# EAGLE design boilers2 (EAGLE 7.2.0)
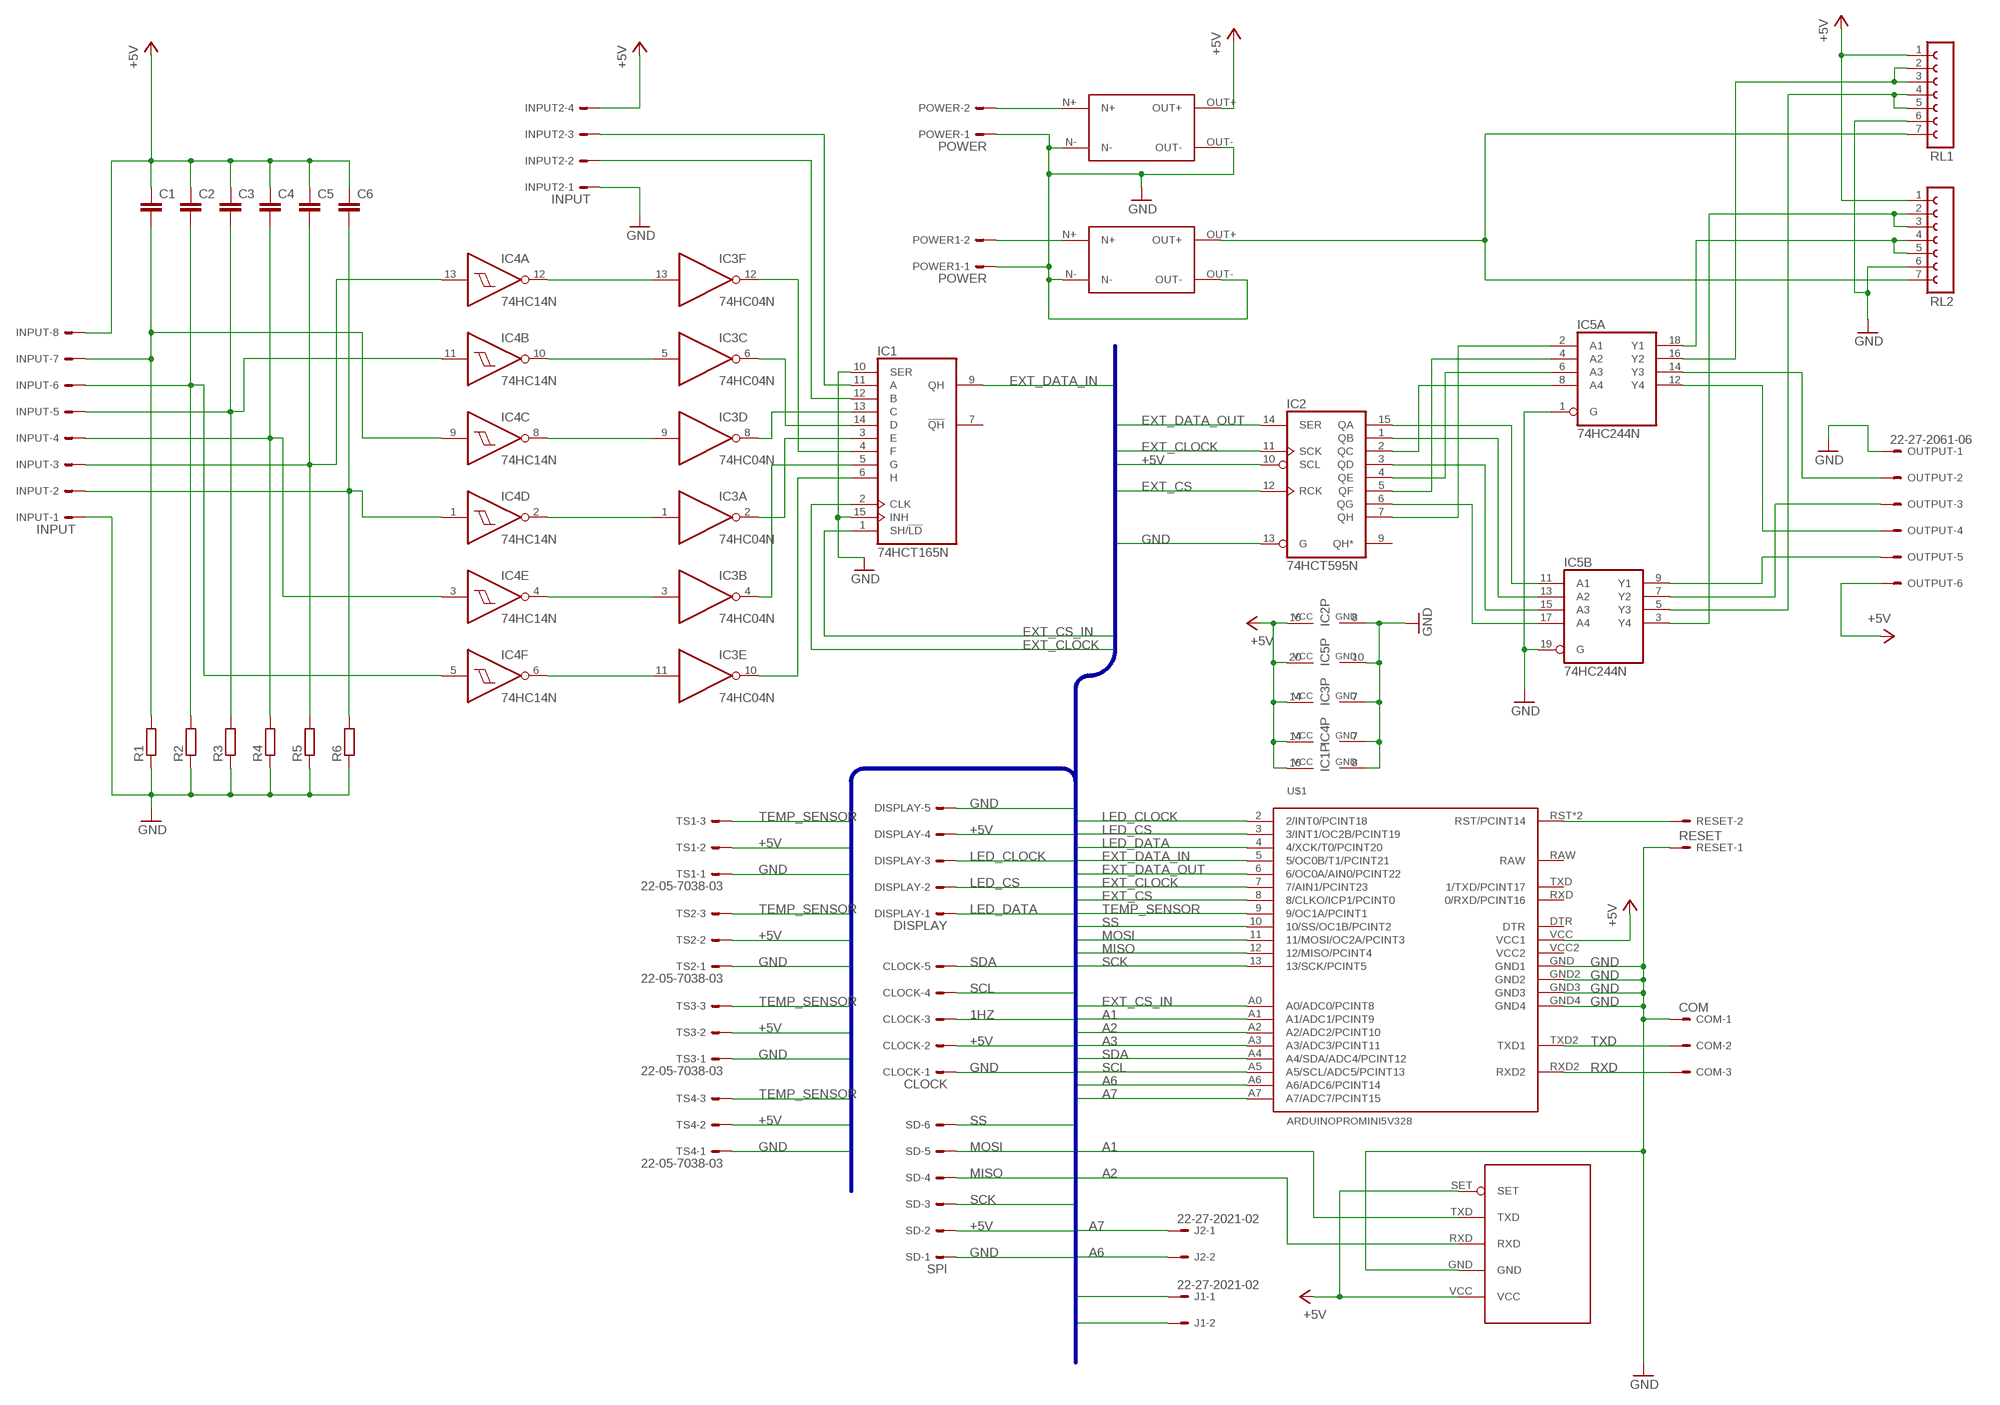
[diagram p0: schematic, sheet 1]

## Parts
C1  C-EU050-025X075  [C050-025X075]
C2  C-EU050-025X075  [C050-025X075]
C3  C-EU050-025X075  [C050-025X075]
C4  C-EU050-025X075  [C050-025X075]
C5  C-EU050-025X075  [C050-025X075]
C6  C-EU050-025X075  [C050-025X075]
CLOCK  CLOCK  22-27-2051-05  [6410-05]
COM  COM  22-27-2031-03  [6410-03]
DISPLAY  DISPLAY  22-27-2051-05  [6410-05]
IC1  74HCT165N  [DIL16]
IC2  74HCT595N  [DIL16]
IC3  74HC04N  [DIL14]
IC4  74HC14N  [DIL14]
IC5  74HC244N  [DIL20]
INPUT  INPUT  22-27-2081-08  [6410-08]
INPUT2  INPUT  22-27-2041-04  [6410-04]
J1  22-27-2021-02  [6410-02]
J2  22-27-2021-02  [6410-02]
OUTPUT  22-27-2061-06  [6410-06]
POWER  POWER  22-27-2021-02  [6410-02]
POWER1  POWER  22-27-2021-02  [6410-02]
R1  R-EU_0411/15  [0411/15]
R2  R-EU_0411/15  [0411/15]
R3  R-EU_0411/15  [0411/15]
R4  R-EU_0411/15  [0411/15]
R5  R-EU_0411/15  [0411/15]
R6  R-EU_0411/15  [0411/15]
RESET  RESET  22-27-2021-02  [6410-02]
RL1  FE07-1  [FE07]
RL2  FE07-1  [FE07]
SD  SPI  22-27-2061-06  [6410-06]
TS1  22-05-7038-03  [7395-03]
TS2  22-05-7038-03  [7395-03]
TS3  22-05-7038-03  [7395-03]
TS4  22-05-7038-03  [7395-03]
U$1  ARDUINOPROMINI5V328  [ARDUINOMINIPRO5V328]
U$4  5V_STAB  [5V_STAB]
U$5  5V_STAB  [5V_STAB]
U$6  HC-11  [HC-11]

## Nets
1HZ: CLOCK.3
+5V: C1.1 C2.1 C3.1 C4.1 C5.1 C6.1 CLOCK.2 DISPLAY.4 IC1.16(VCC) IC2.10(SCL) IC2.16(VCC) IC3.14(P:VCC) IC4.14(P:VCC) IC5.20(P:VCC) INPUT2.4 INPUT.8 J1.1 OUTPUT.6 RL1.1 RL2.1 SD.2 TS1.2 TS2.2 TS3.2 TS4.2 U$1.VCC(VCC1) U$4.OUT+ U$6.SET U$6.VCC
A1: U$1.A1(A1/ADC1/PCINT9) U$6.TXD
A2: U$1.A2(A2/ADC2/PCINT10) U$6.RXD
A3: J1.2 U$1.A3(A3/ADC3/PCINT11)
A6: J2.2 U$1.A6(A6/ADC6/PCINT14)
A7: J2.1 U$1.A7(A7/ADC7/PCINT15)
EXT_CLOCK: IC1.2(CLK) IC2.11(SCK) U$1.7(7/AIN1/PCINT23)
EXT_CS: IC2.12(RCK) U$1.8(8/CLKO/ICP1/PCINT0)
EXT_CS_IN: IC1.1(SH/!LD) U$1.A0(A0/ADC0/PCINT8)
EXT_DATA_IN: IC1.9(QH) U$1.5(5/OC0B/T1/PCINT21)
EXT_DATA_OUT: IC2.14(SER) U$1.6(6/OC0A/AIN0/PCINT22)
GND: CLOCK.1 COM.1 DISPLAY.5 IC1.8(GND) IC1.10(SER) IC1.15(INH) IC2.8(GND) IC2.13(G) IC3.7(P:GND) IC4.7(P:GND) IC5.1(A:G) IC5.10(P:GND) IC5.19(B:G) INPUT2.1 INPUT.1 OUTPUT.1 POWER1.1 POWER.1 R1.1 R2.1 R3.1 R4.1 R5.1 R6.1 RESET.1 RL1.6 RL2.6 SD.1 TS1.1 TS2.1 TS3.1 TS4.1 U$1.GND2 U$1.GND3 U$1.GND4 U$1.GND(GND1) U$4.N- U$4.OUT- U$5.N- U$5.OUT- U$6.GND
LED_CLOCK: DISPLAY.3 U$1.2(2/INT0/PCINT18)
LED_CS: DISPLAY.2 U$1.3(3/INT1/OC2B/PCINT19)
LED_DATA: DISPLAY.1 U$1.4(4/XCK/T0/PCINT20)
MISO: SD.4 U$1.12(12/MISO/PCINT4)
MOSI: SD.5 U$1.11(11/MOSI/OC2A/PCINT3)
N$1: IC3.13(F:I) IC4.12(A:O)
N$2: IC3.5(C:I) IC4.10(B:O)
N$3: IC3.9(D:I) IC4.8(C:O)
N$4: IC3.1(A:I) IC4.2(D:O)
N$5: IC3.3(B:I) IC4.4(E:O)
N$6: IC3.11(E:I) IC4.6(F:O)
N$7: IC2.15(QA) IC5.11(B:A1)
N$8: IC2.1(QB) IC5.13(B:A2)
N$9: IC2.3(QD) IC5.15(B:A3)
N$10: IC2.6(QG) IC5.17(B:A4)
N$11: IC2.7(QH) IC5.2(A:A1)
N$12: IC2.2(QC) IC5.8(A:A4)
N$13: IC2.4(QE) IC5.6(A:A3)
N$14: IC2.5(QF) IC5.4(A:A2)
N$15: IC1.11(A) INPUT2.3
N$16: IC1.5(G) IC3.4(B:O)
N$17: IC1.6(H) IC3.10(E:O)
N$18: IC1.3(E) IC3.2(A:O)
N$19: IC1.13(C) IC3.8(D:O)
N$20: IC1.14(D) IC3.6(C:O)
N$21: IC1.4(F) IC3.12(F:O)
N$22: C1.2 IC4.9(C:I) INPUT.7 R1.2
N$23: C2.2 IC4.5(F:I) INPUT.6 R2.2
N$24: IC1.12(B) INPUT2.2
N$25: IC5.16(A:Y2) RL1.2 RL1.3
N$26: C5.2 IC4.13(A:I) INPUT.3 R5.2
N$27: C6.2 IC4.1(D:I) INPUT.2 R6.2
N$28: IC5.3(B:Y4) RL2.2 RL2.3
N$29: C3.2 IC4.11(B:I) INPUT.5 R3.2
N$30: C4.2 IC4.3(E:I) INPUT.4 R4.2
N$31: IC5.18(A:Y1) RL2.4 RL2.5
N$32: IC5.5(B:Y3) RL1.4 RL1.5
N$33: IC5.14(A:Y3) OUTPUT.2
N$34: IC5.7(B:Y2) OUTPUT.3
N$35: IC5.12(A:Y4) OUTPUT.4
N$36: IC5.9(B:Y1) OUTPUT.5
N$37: POWER.2 U$4.N+
N$38: RL1.7 RL2.7 U$5.OUT+
N$39: RESET.2 U$1.RST2(RST/PCINT14) U$1.RST(RST/PCINT14)
N$40: POWER1.2 U$5.N+
RXD: COM.3 U$1.RXD2
SCK: SD.3 U$1.13(13/SCK/PCINT5)
SCL: CLOCK.4 U$1.A5(A5/SCL/ADC5/PCINT13)
SDA: CLOCK.5 U$1.A4(A4/SDA/ADC4/PCINT12)
SS: SD.6 U$1.10(10/SS/OC1B/PCINT2)
TEMP_SENSOR: TS1.3 TS2.3 TS3.3 TS4.3 U$1.9(9/OC1A/PCINT1)
TXD: COM.2 U$1.TXD2(TXD1)
Unconnected: IC1.7(!QH) IC2.9(QH*) U$1.DTR U$1.RAW U$1.RXD(0/RXD/PCINT16) U$1.TXD(1/TXD/PCINT17)

## Buses
A,B,C,D,E,F,G,H,GND,+5V,BOILER,PUMP,EXT_CLOCK,TEMP_SENSOR,SDA,SCL,1HZ,LED_DATA,LED_CS,LED_CLOCK,SS,MOSI,MISO,SCK,EXT_DATA_OUT,LOAD,EXT_CS_IN,EXT_CS,EXT_DATA_IN,A1,A2,A3,A6,A7
+5V,GND,TEMP_SENSOR

## Power pins joined to a net without a drawn wire
VCC2: U$1.VCC2

## Library data of the parts
C1-C6 = rcl:C-EU: CAPACITOR, European symbol
CLOCK DISPLAY = con-molex:22-?-05: CONNECTOR wire to board 2.54 mm (.1 inch) pitch header; OC_FARNELL: unknown; OC_NEWARK: unknown
COM TS1-TS4 = con-molex:22-?-03: CONNECTOR wire to board 2.54 mm (.1 inch) pitch header; OC_FARNELL: unknown; OC_NEWARK: unknown
IC1 = 74xx-eu:74*165: 8-bit parallel load SHIFT REGISTER
IC2 = 74xx-eu:74*595: 8-bit SHIFT REGISTER, output latch
IC3 = 74xx-eu:74*04: Hex INVERTER
IC4 = 74xx-eu:74*14: Hex schmitt trigger INVERTER
IC5 = 74xx-eu:74*244: Octal BUFFER and LINE DRIVER, 3-state
INPUT = con-molex:22-?-08: CONNECTOR wire to board 2.54 mm (.1 inch) pitch header; OC_FARNELL: unknown; OC_NEWARK: unknown
INPUT2 = con-molex:22-?-04: CONNECTOR wire to board 2.54 mm (.1 inch) pitch header; OC_FARNELL: unknown; OC_NEWARK: unknown
J1 J2 POWER POWER1 RESET = con-molex:22-?-02: CONNECTOR wire to board 2.54 mm (.1 inch) pitch header; OC_FARNELL: unknown; OC_NEWARK: unknown
OUTPUT SD = con-molex:22-?-06: CONNECTOR wire to board 2.54 mm (.1 inch) pitch header; OC_FARNELL: unknown; OC_NEWARK: unknown
R1-R6 = rcl:R-EU_: RESISTOR, European symbol
RL1 RL2 = con-lsta:FE07-1: FEMALE HEADER; OC_FARNELL: unknown; OC_NEWARK: unknown
U$1 = arduino:ARDUINOPROMINI5V328
U$4 U$5 = arduino:5V_STAB
U$6 = arduino:HC-11

## Board
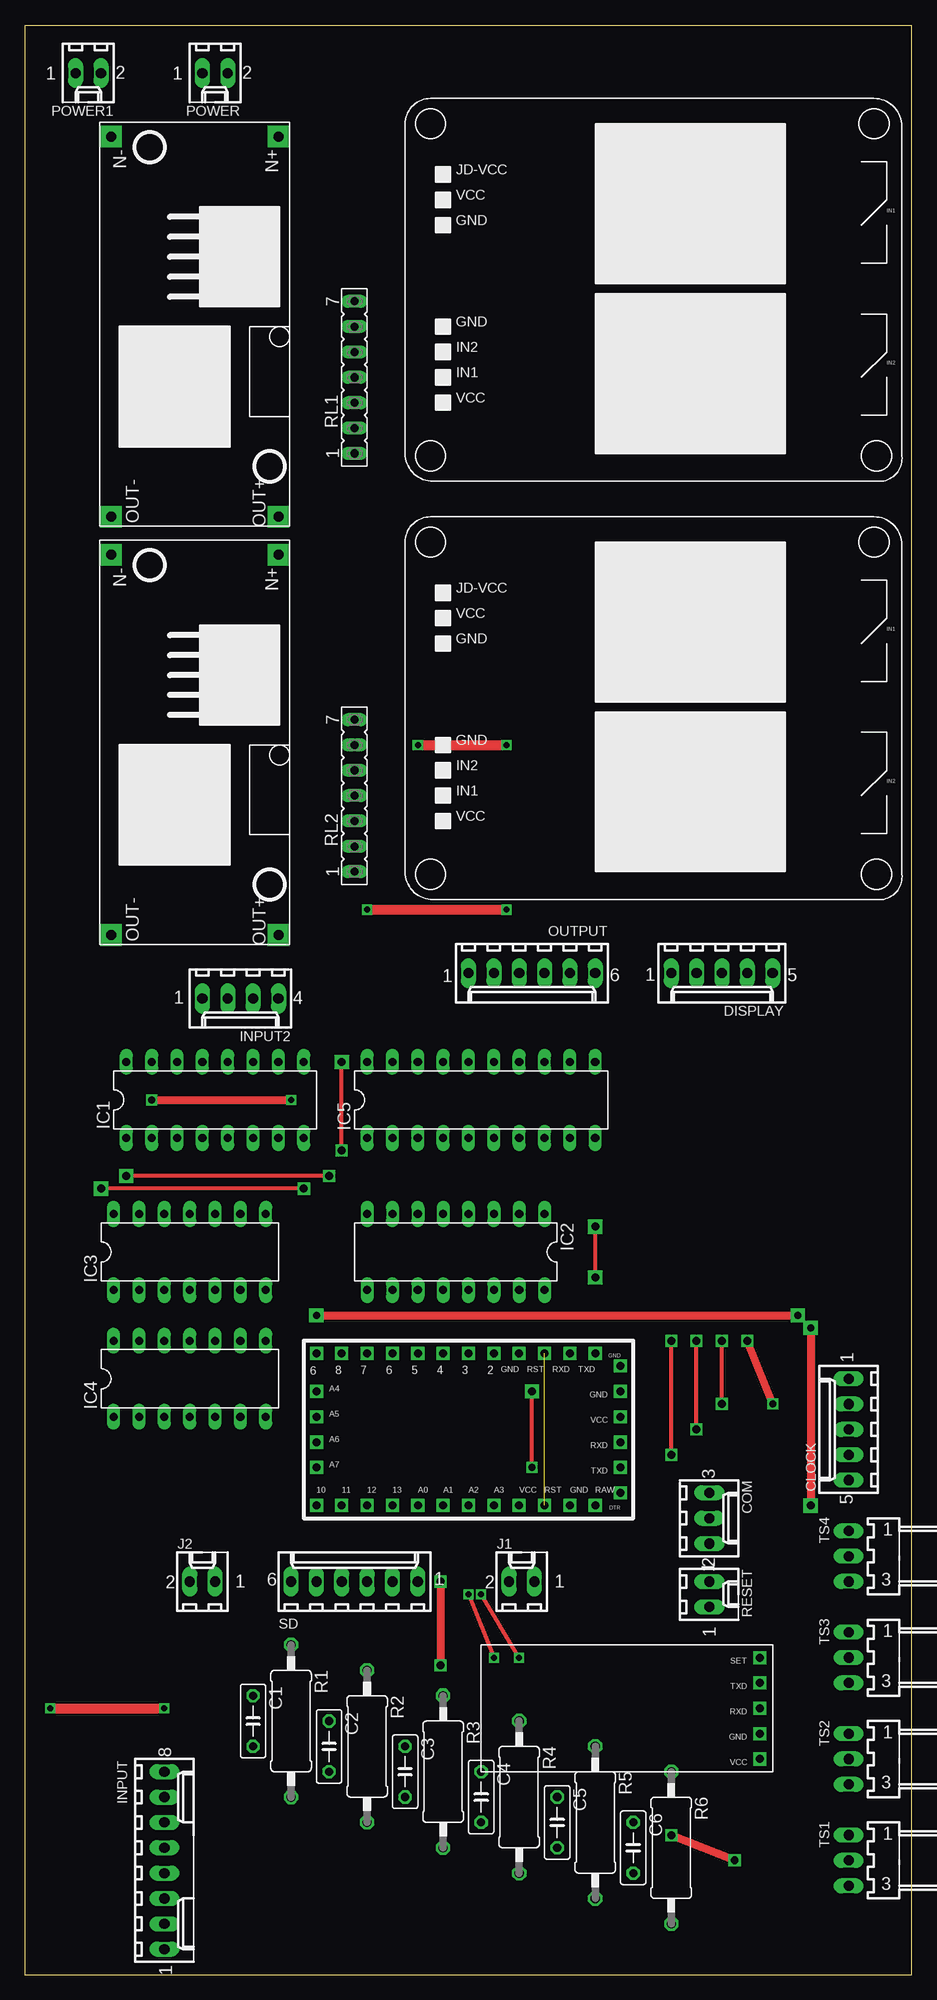
[diagram p1: board, top side]
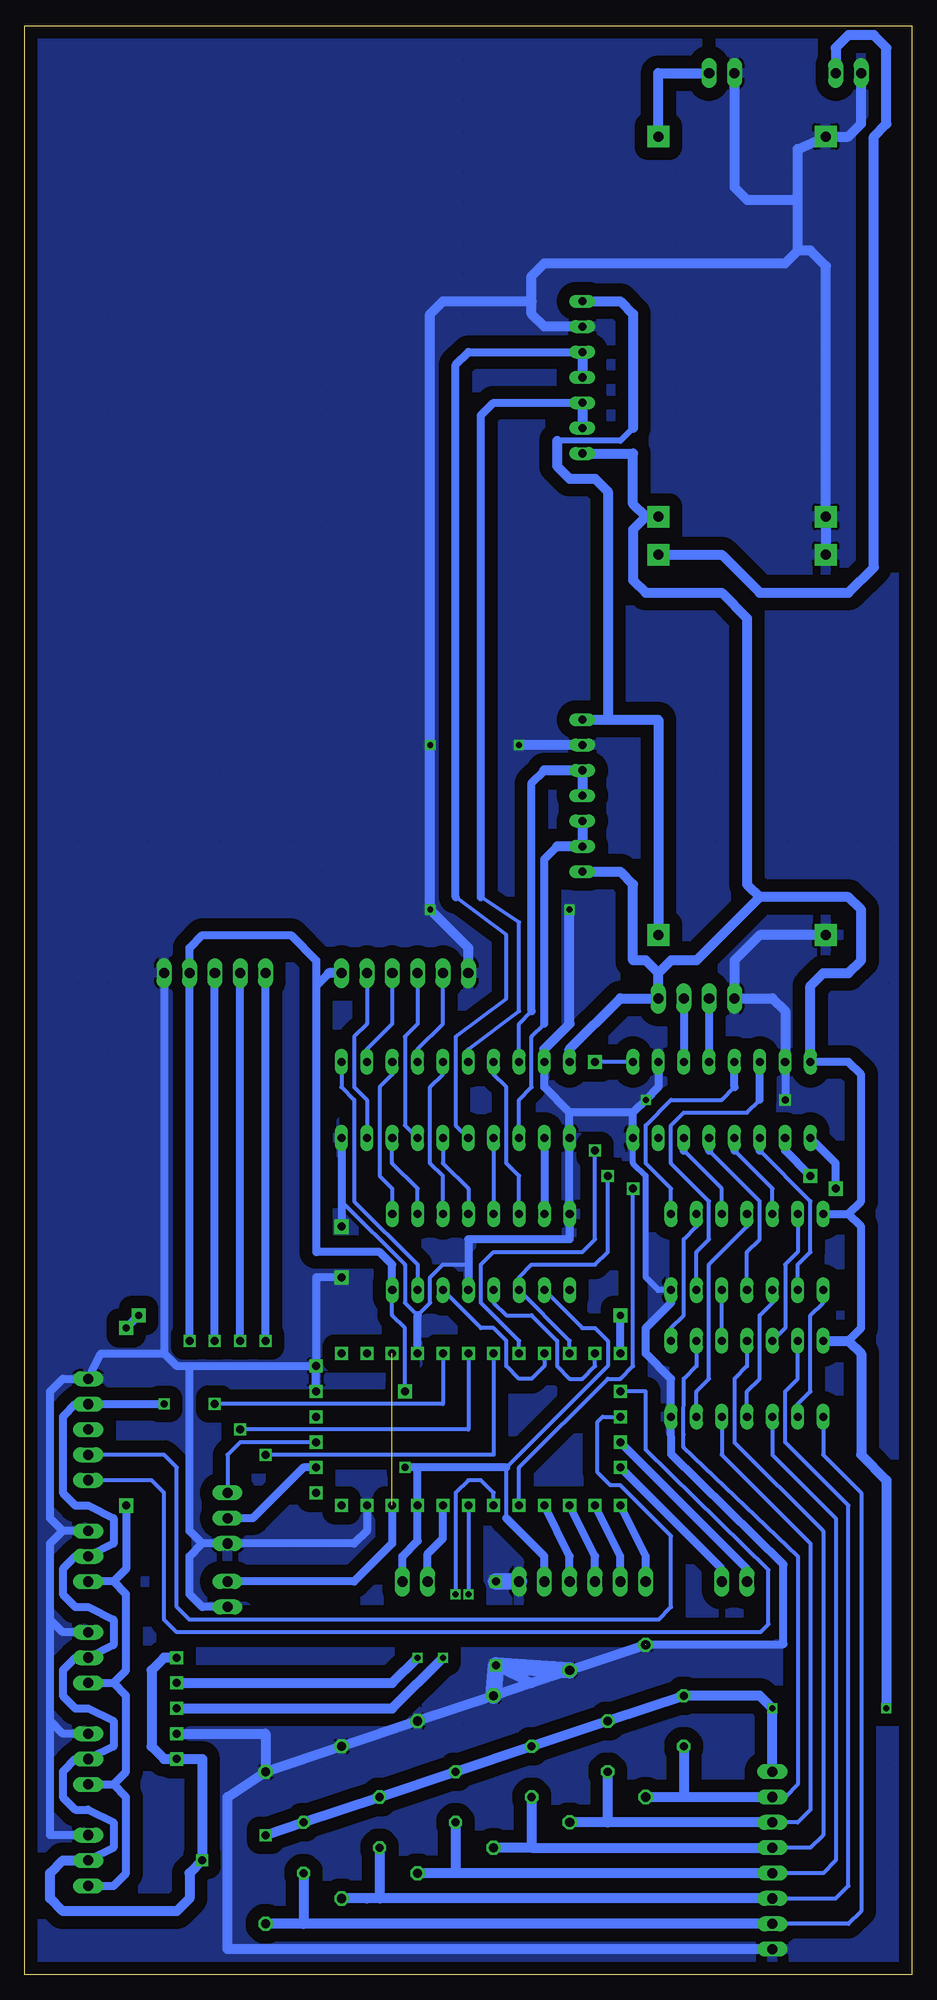
[diagram p2: board, bottom side, seen from below]

Size 88.88 x 195.25 mm. Coordinates in mm from the lower left corner, seen from the top.
Outline: 0,0 88.88,0 88.88,195.25 0,195.25 0,0
Copper layers (1*16): Top 0.035mm / dielectric 1.5mm / Bottom 0.035mm
Design rules "default": minimum track width 10mil, minimum drill 24mil, track to track 8mil, track to pad 8mil, pad to pad 8mil, via to via 8mil, smd to smd 8mil, copper to edge 40mil, drill to drill 8mil, minimum pad ring 10mil, minimum via ring 8mil, stop-mask expansion 4mil, vias tented up to drill 0mil, thermal gap 10mil

### Footprints (pad centres in the part's own frame; a part is rotated, then mirrored left to right if it is on the bottom)
C050-025X075 = drill 0.813 octagon: 1 -2.54,0; 2 2.54,0
6410-05 = drill 1.016 long: 1 5.08,0; 2 2.54,0; 3 0,0; 4 -2.54,0; 5 -5.08,0
6410-03 = drill 1.016 long: 1 2.54,0; 2 0,0; 3 -2.54,0
DIL16 = drill 0.813 long: 1 -8.89,-3.81; 2 -6.35,-3.81; 3 -3.81,-3.81; 4 -1.27,-3.81; 5 1.27,-3.81; 6 3.81,-3.81; 7 6.35,-3.81; 8 8.89,-3.81; 9 8.89,3.81; 10 6.35,3.81; 11 3.81,3.81; 12 1.27,3.81; 13 -1.27,3.81; 14 -3.81,3.81; 15 -6.35,3.81; 16 -8.89,3.81
DIL14 = drill 0.813 long: 1 -7.62,-3.81; 2 -5.08,-3.81; 3 -2.54,-3.81; 4 0,-3.81; 5 2.54,-3.81; 6 5.08,-3.81; 7 7.62,-3.81; 8 7.62,3.81; 9 5.08,3.81; 10 2.54,3.81; 11 0,3.81; 12 -2.54,3.81; 13 -5.08,3.81; 14 -7.62,3.81
DIL20 = drill 0.813 long: 1 -11.43,-3.81; 2 -8.89,-3.81; 3 -6.35,-3.81; 4 -3.81,-3.81; 5 -1.27,-3.81; 6 1.27,-3.81; 7 3.81,-3.81; 8 6.35,-3.81; 9 8.89,-3.81; 10 11.43,-3.81; 11 11.43,3.81; 12 8.89,3.81; 13 6.35,3.81; 14 3.81,3.81; 15 1.27,3.81; 16 -1.27,3.81; 17 -3.81,3.81; 18 -6.35,3.81; 19 -8.89,3.81; 20 -11.43,3.81
6410-08 = drill 1.016 long: 1 8.89,0; 2 6.35,0; 3 3.81,0; 4 1.27,0; 5 -1.27,0; 6 -3.81,0; 7 -6.35,0; 8 -8.89,0
6410-04 = drill 1.016 long: 1 3.81,0; 2 1.27,0; 3 -1.27,0; 4 -3.81,0
6410-02 = drill 1.016 long: 1 1.27,0; 2 -1.27,0
6410-06 = drill 1.016 long: 1 6.35,0; 2 3.81,0; 3 1.27,0; 4 -1.27,0; 5 -3.81,0; 6 -6.35,0
0411/15 = drill 0.914 octagon: 1 -7.62,0; 2 7.62,0
FE07 = drill 0.813 long: 1 -7.62,0; 2 -5.08,0; 3 -2.54,0; 4 0,0; 5 2.54,0; 6 5.08,0; 7 7.62,0
7395-03 = drill 1.016 long: 1 2.54,0; 2 0,0; 3 -2.54,0
ARDUINOMINIPRO5V328 = drill 0.8 square: 2 -3.81,-3.81; 3 -1.27,-3.81; 4 1.27,-3.81; 5 3.81,-3.81; 6 6.35,-3.81; 7 8.89,-3.81; 8 11.43,-3.81; 9 13.97,-3.81; 10 13.97,11.43; 11 11.43,11.43; 12 8.89,11.43; 13 6.35,11.43; A0 3.81,11.43; A1 1.27,11.43; A2 -1.27,11.43; A3 -3.81,11.43; A4 13.97,0; A5 13.97,2.54; A6 13.97,5.08; A7 13.97,7.62; DTR -16.51,10.16; GND -6.35,-3.81; GND2 -11.43,11.43; GND3 -16.51,0; GND4 -16.51,-2.54; RAW -13.97,11.43; RST -8.89,-3.81; RST2 -8.89,11.43; RXD -11.43,-3.81; RXD2 -16.51,5.08; TXD -13.97,-3.81; TXD2 -16.51,7.62; VCC -6.35,11.43; VCC2 -16.51,2.54
5V_STAB = drill 1 pad 2.184 square: N+ -19.05,8.89; N- -19.05,-7.89; OUT+ 19.05,8.89; OUT- 19.05,-7.89
HC-11 = drill 0.8 square: GND -7.62,2.54; RXD -7.62,0; SET -7.62,-5.08; TXD -7.62,-2.54; VCC -7.62,5.08

### Placement (x,y rotation side)
C1  22.86,25.4 270 top
C2  30.48,22.86 270 top
C3  38.1,20.32 270 top
C4  45.72,17.78 270 top
C5  53.34,15.24 270 top
C6  60.96,12.7 270 top
CLOCK  82.55,54.61 90 top
COM  68.58,45.72 270 top
DISPLAY  69.85,100.33 180 top
IC1  19.05,87.63 0 top
IC2  43.18,72.39 180 top
IC3  16.51,72.39 0 top
IC4  16.51,59.69 0 top
IC5  45.72,87.63 0 top
INPUT  13.97,11.43 270 top
INPUT2  21.59,97.79 180 top
J1  49.78,39.37 0 top
J2  17.78,39.37 0 top
OUTPUT  50.8,100.33 180 top
POWER  19.05,190.5 180 top
POWER1  6.35,190.5 180 top
R1  26.67,25.4 270 top
R2  34.29,22.86 270 top
R3  41.91,20.32 270 top
R4  49.53,17.78 270 top
R5  57.15,15.24 270 top
R6  64.77,12.7 270 top
RESET  68.58,38.1 270 top
RL1  33.02,160.02 90 top
RL2  33.02,118.11 90 top
SD  33.02,39.37 0 top
TS1  82.55,11.43 90 top
TS2  82.55,21.59 90 top
TS3  82.55,31.75 90 top
TS4  82.55,41.91 90 top
U$1  43.18,58.42 180 top
U$2  [2CHAN_RELAY_5V]  64.77,134.62 0 top
U$3  [2CHAN_RELAY_5V]  64.77,176.53 0 top
U$4  16.51,165.1 270 top
U$5  16.51,123.19 270 top
U$6  66.04,26.67 180 top

### Tracks (layer width: path | path; a pad name or v marks a point on that pad's centre or on a via)
+5V  (via drill 0.6, 0.7, 0.8, 0.8 pad 1.42)
  Top 0.406: v50.8,50.8 v50.8,58.42
  Top 0.813: v74.93,57.15 v72.39,63.5 | v64.77,13.97 v71.12,11.43
  Top 1.016: v2.54,26.67 v13.97,26.67
  Bottom 0.406: v50.8,58.42 50.8,64.77 52.07,66.04 IC2.16 | IC2.10 33.02,64.77 31.75,64.77 30.48,63.5 30.48,60.96 40.64,50.8 40.64,45.72
  Bottom 0.61: 39.37,44.45 40.64,45.72
  Bottom 0.813: 58.42,100.33 59.69,99.06 | 59.69,99.06 59.69,72.39 53.34,72.39 52.07,71.12 IC2.16 | 6.35,63.5 5.08,64.77 5.08,74.93 6.35,76.2 | IC3.14 6.35,76.2 | 6.35,76.2 5.08,77.47 5.08,90.17 6.35,91.44 IC1.16 | 59.69,99.06 59.69,101.6 62.23,104.14 71.12,104.14 72.39,102.87 DISPLAY.4 v72.39,63.5 | 40.64,50.8 49.53,50.8 | 49.53,50.8 v50.8,50.8 | 49.53,50.8 U$1.VCC 49.53,43.43 51.05,41.91 J1.1 | v74.93,57.15 CLOCK.2 83.82,57.15 85.09,55.88 85.09,48.26 83.82,46.99 82.55,46.99 80.01,45.72 80.01,43.18 TS4.2 83.82,41.91 85.09,40.64 85.09,38.1 83.82,36.83 82.55,36.83 80.01,35.56 80.01,33.02 TS3.2 83.82,31.75 85.09,30.48 85.09,27.94 83.82,26.67 82.55,26.67 80.01,25.4 80.01,22.86 TS2.2 83.82,21.59 85.09,20.32 85.09,17.78 83.82,16.51 82.55,16.51 80.01,15.24 80.01,12.7 TS1.2 | SD.2 36.83,41.91 40.64,45.72
  Bottom 1.016: INPUT.8 v13.97,26.67 15.24,27.94 C1.1 C2.1 C3.1 C4.1 C5.1 C6.1 v64.77,13.97 | TS1.2 85.09,11.43 86.36,10.16 86.36,7.62 85.09,6.35 73.66,6.35 72.39,7.62 72.39,10.16 v71.12,11.43 71.12,21.59 U$6.VCC 74.93,21.59 76.2,22.86 76.2,30.48 74.93,31.75 U$6.SET | OUTPUT.6 58.42,100.33 | U$4.OUT+ 26.67,146.05 | 26.67,146.05 27.94,147.32 27.94,152.4 RL1.1 | IC1.16 10.16,99.06 8.89,100.33 6.35,100.33 5.08,101.6 5.08,106.68 6.35,107.95 15.24,107.95 | 15.24,107.95 21.59,101.6 24.13,101.6 25.4,100.33 | 25.4,100.33 INPUT2.4 29.21,97.79 34.29,92.71 IC5.20 | 25.4,100.33 26.67,101.6 27.94,101.6 27.94,109.22 29.21,110.49 RL2.1 | 26.67,146.05 27.94,144.78 27.94,139.7 26.67,138.43 19.05,138.43 16.51,135.89 16.51,109.22 15.24,107.95 | IC4.14 6.35,63.5 5.08,62.23 5.08,52.07 2.54,49.53 v2.54,26.67
A1  (via drill 0.6)
  Top 0.406: v45.72,38.1 v49.53,31.75
  Bottom 0.406: U$1.A1 41.91,48.26 43.18,49.53 44.45,49.53 45.72,48.26 v45.72,38.1
  Bottom 1.016: v49.53,31.75 52.07,29.21 U$6.TXD
A2  (via drill 0.6)
  Top 0.406: v44.45,38.1 v46.99,31.75
  Bottom 0.406: U$1.A2 v44.45,38.1
  Bottom 1.016: v46.99,31.75 52.07,26.67 U$6.RXD
A3
  Bottom 0.813: J1.2 48.51,42.16 46.99,43.69 U$1.A3
A6
  Bottom 0.813: U$1.A6 16.51,40.64 J2.2
A7
  Bottom 0.813: U$1.A7 19.05,40.64 J2.1
EXT_CLOCK  (via drill 0.8, 0.8 pad 1.42)
  Top 0.406: v30.48,80.01 v10.16,80.01
  Bottom 0.406: U$1.7 34.29,63.5 IC2.11 39.37,69.85 38.1,71.12 31.75,71.12 30.48,72.39 v30.48,80.01
  Bottom 0.813: v10.16,80.01 12.7,82.55 IC1.2
EXT_CS
  Bottom 0.406: IC2.12 41.91,67.31 40.64,66.04 38.1,66.04 35.56,63.5 35.56,60.96 34.29,59.69 33.02,59.69 31.75,60.96 U$1.8
EXT_CS_IN  (via drill 0.8 pad 1.27, 0.8 pad 1.42)
  Top 0.406: v27.94,78.74 v7.62,78.74
  Bottom 0.406: U$1.A0 39.37,50.8 30.48,59.69 29.21,59.69 27.94,60.96 v27.94,78.74
  Bottom 0.813: v7.62,78.74 7.62,81.28 IC1.1
EXT_DATA_IN  (via drill 0.8, 0.8 pad 1.42)
  Top 0.406: v31.75,82.55 v31.75,91.44
  Bottom 0.406: v31.75,82.55 31.75,73.66 33.02,72.39 41.91,72.39 43.18,71.12 43.18,67.31 39.37,63.5 U$1.5 | IC1.9 v31.75,91.44
EXT_DATA_OUT
  Bottom 0.406: U$1.6 36.83,60.96 38.1,59.69 39.37,59.69 40.64,60.96 40.64,63.5 41.91,64.77 43.18,64.77 IC2.14
GND  (via drill 0.6, 0.7, 0.8, 0.8 pad 1.42)  (1 unrouted)
  Top 0.406: v57.15,69.85 v57.15,74.93
  Top 0.813: v12.7,87.63 v26.67,87.63 | v41.66,39.37 v41.66,30.99
  Top 1.016: v39.37,123.19 v48.26,123.19 | v34.29,106.68 v48.26,106.68
  Bottom 0.406: 44.45,71.12 46.99,71.12 48.26,69.85 48.26,67.31 49.53,66.04 50.8,67.31 50.8,71.12 57.15,77.47 v57.15,74.93
  Bottom 0.61: IC3.7 25.4,68.58 26.67,69.85 26.67,80.01 27.94,81.28 IC1.8
  Bottom 0.813: 34.29,86.36 IC5.1 IC2.8 34.29,73.66 44.45,73.66 44.45,71.12 IC2.13 | 34.29,86.36 36.83,88.9 IC5.19 | IC1.10 25.4,88.9 v26.67,87.63 27.94,86.36 | IC3.7 24.13,67.31 26.67,64.77 26.67,62.23 24.13,59.69 IC4.7 24.11,52.13 12.87,41.08 12.87,33.1 26.64,33.1 | IC1.15 v12.7,87.63 | IC5.10 v57.15,74.93 | v57.15,69.85 59.69,69.85 U$1.GND4 | DISPLAY.5 74.93,62.23 | 74.93,62.23 73.66,60.96 72.39,60.96 | 72.39,60.96 U$1.GND4 | 71.12,43.18 COM.1 55.88,43.18 54.61,44.45 U$1.GND2 | 71.12,43.18 72.39,44.45 72.39,60.96 | RESET.1 71.12,36.83 72.39,38.1 72.39,41.91 71.12,43.18 | U$1.GND3 U$1.GND4 | TS3.1 85.09,34.29 86.36,35.56 | 86.36,35.56 86.36,43.18 85.09,44.45 | TS2.1 85.09,24.13 86.36,25.4 | 86.36,25.4 86.36,35.56 | TS1.1 86.36,13.97 86.36,25.4 | 74.93,62.23 81.28,62.23 CLOCK.1 85.09,59.69 86.36,58.42 86.36,45.72 85.09,44.45 | TS4.1 85.09,44.45 | U$1.GND 49.53,66.04 | IC1.8 27.94,86.36 | 27.94,86.36 34.29,86.36
  Bottom 1.016: 38.1,29.21 R2.1 R1.1 | 38.1,29.21 R3.1 R4.1 R5.1 R6.1 | v41.66,30.99 38.1,29.21 | INPUT.1 68.58,2.54 68.58,17.78 R6.1 | 38.1,167.64 38.1,166.37 36.83,165.1 RL1.6 | 38.1,167.64 38.1,170.18 36.83,171.45 12.7,171.45 11.43,172.72 | 11.43,172.72 11.43,177.8 | 11.43,177.8 11.43,182.88 U$4.N- 6.35,184.15 5.08,185.42 POWER1.1 | OUTPUT.1 44.45,102.87 v48.26,106.68 v48.26,123.19 48.26,166.37 46.99,167.64 38.1,167.64 | POWER.1 17.78,179.07 16.51,177.8 11.43,177.8 | U$5.N- U$4.OUT- 8.62,171.18 10.16,172.72 11.43,172.72 | U$5.OUT- 15.24,104.14 17.78,101.6 INPUT2.1 13.97,97.79 12.7,96.52 IC1.15 | IC5.19 36.83,92.71 34.29,95.25 v34.29,106.68 | RL2.6 v39.37,123.19 | R6.1 64.77,24.13 U$6.GND
  Bottom 1.676: SD.1 v41.66,39.37 | R3.1 v41.66,30.99 R2.1
  pour Bottom (isolate 1.27, hatched): 0,195.58 88.9,195.58 88.9,0 0,0
LED_CLOCK  (via drill 0.8)
  Top 0.406: v69.85,57.15 v69.85,63.5
  Bottom 0.406: U$1.2 46.99,57.15 v69.85,57.15
  Bottom 0.813: v69.85,63.5 DISPLAY.3
LED_CS  (via drill 0.8)
  Top 0.406: v67.31,54.61 v67.31,63.5
  Bottom 0.406: U$1.3 44.45,54.61 v67.31,54.61
  Bottom 0.813: v67.31,63.5 DISPLAY.2
LED_DATA  (via drill 0.8)
  Top 0.406: v64.77,52.07 v64.77,63.5
  Bottom 0.406: U$1.4 41.91,52.07 v64.77,52.07
  Bottom 0.813: v64.77,63.5 DISPLAY.1
MISO
  Bottom 0.813: SD.4 31.75,41.91 U$1.12
MOSI
  Bottom 0.813: SD.5 29.21,41.91 U$1.11
N$1
  Bottom 0.406: IC3.13 11.43,72.39 12.7,71.12 12.7,64.77 IC4.12
N$2
  Bottom 0.406: IC4.10 IC3.5
N$3
  Bottom 0.406: IC4.8 24.13,64.77 22.86,66.04 22.86,73.66 21.59,74.93 IC3.9
N$4
  Bottom 0.406: IC4.2 11.43,57.15 10.16,58.42 10.16,66.04 8.89,67.31 IC3.1
N$5
  Bottom 0.406: IC4.4 16.51,58.42 15.24,59.69 15.24,66.04 13.97,67.31 IC3.3
N$6
  Bottom 0.406: IC4.6 21.59,58.42 20.32,59.69 20.32,71.12 16.51,74.93 IC3.11
N$7
  Bottom 0.406: IC5.11 57.15,88.9 55.88,87.63 55.88,77.47 49.53,71.12 IC2.15 49.53,69.85
N$8
  Bottom 0.406: IC5.13 52.07,90.17 53.34,88.9 53.34,80.01 52.07,78.74 IC2.1
N$9
  Bottom 0.406: IC2.3 46.99,80.01 48.26,81.28 48.26,88.9 46.99,90.17 IC5.15
N$10
  Bottom 0.406: IC2.6 39.37,80.01 40.64,81.28 40.64,88.9 41.91,90.17 IC5.17
N$11
  Bottom 0.813: IC5.2 IC2.7
N$12
  Bottom 0.406: IC2.2 49.53,78.74 52.07,81.28 IC5.8
N$13
  Bottom 0.406: IC5.6 46.99,81.28 44.45,78.74 IC2.4
N$14
  Bottom 0.406: IC5.4 IC2.5
N$15
  Bottom 0.813: INPUT2.3 IC1.11
N$16
  Bottom 0.406: IC3.4 16.51,72.39 15.24,73.66 15.24,77.47 20.32,82.55
  Bottom 0.813: 20.32,82.55 IC1.5
N$17
  Bottom 0.406: IC3.10 19.05,78.74 22.86,82.55
  Bottom 0.813: 22.86,82.55 IC1.6
N$18
  Bottom 0.406: IC3.2 11.43,71.12 10.16,72.39 10.16,77.47 15.24,82.55
  Bottom 0.813: 15.24,82.55 IC1.3
N$19
  Bottom 0.406: IC3.8 24.13,78.74 26.67,81.28 26.67,85.09 24.13,87.63 19.05,87.63 17.78,88.9
  Bottom 0.813: 17.78,88.9 IC1.13
N$20
  Bottom 0.406: IC3.6 21.59,72.39 20.32,73.66 20.32,77.47 24.13,81.28 24.13,85.09 22.86,86.36 16.51,86.36 15.24,87.63
  Bottom 0.813: 15.24,87.63 IC1.14
N$21
  Bottom 0.406: IC3.12 13.97,78.74 17.78,82.55
  Bottom 0.813: 17.78,82.55 IC1.4
N$22
  Bottom 0.406: IC4.9 21.59,60.96 22.86,59.69 22.89,54.1 22.88,52.83 11.43,41.91 11.43,19.05 12.7,17.78 INPUT.7
  Bottom 1.016: INPUT.7 22.86,17.78 | 22.86,17.78 R1.2 | C1.2 22.86,17.78
N$23
  Bottom 0.406: IC4.5 19.05,52.07 10.16,43.18 10.16,16.51 11.43,15.24 INPUT.6
  Bottom 1.016: INPUT.6 30.48,15.24 | 30.48,15.24 C2.2 | 30.48,15.24 R2.2
N$24
  Bottom 0.813: INPUT2.2 IC1.12
N$25
  Bottom 0.406: IC5.16 44.45,92.71 39.37,96.52 39.37,105.41 43.18,107.95
  Bottom 0.813: 43.18,107.95 43.18,156.21 41.91,157.48 RL1.3
  Bottom 1.016: RL1.3 RL1.2
N$26
  Bottom 0.406: INPUT.3 7.62,7.62 6.35,8.89 6.35,46.99 12.7,53.34 12.7,58.42 11.43,59.69 IC4.13
  Bottom 1.016: C5.2 53.34,7.62 | 53.34,7.62 54.61,7.62 R5.2 | INPUT.3 53.34,7.62
N$27
  Bottom 0.406: IC4.1 8.89,52.07 5.08,48.26 5.08,6.35 6.35,5.08 INPUT.2
  Bottom 1.016: C6.2 60.96,5.08 | 60.96,5.08 R6.2 | INPUT.2 60.96,5.08
N$28
  Bottom 0.406: IC5.3 39.37,87.63 38.1,88.9 38.1,93.98 36.83,95.25
  Bottom 0.813: 36.83,95.25 36.83,111.76 35.56,113.03
  Bottom 1.016: 35.56,113.03 RL2.2 RL2.3
N$29
  Bottom 0.406: IC4.11 16.51,60.96 17.78,59.69 17.78,53.34 8.89,44.45 8.89,13.97 10.16,12.7 INPUT.5
  Bottom 1.016: C3.2 38.1,12.7 | 38.1,12.7 R3.2 | 38.1,12.7 INPUT.5
N$30
  Bottom 0.406: IC4.3 13.97,52.07 7.62,45.72 7.62,11.43 8.89,10.16 INPUT.4
  Bottom 1.016: C4.2 45.72,10.16 | 45.72,10.16 R4.2 | INPUT.4 45.72,10.16
N$31
  Bottom 0.406: IC5.18 39.37,95.25 38.1,96.52
  Bottom 0.813: 38.1,96.52 38.1,119.38 36.83,120.65
  Bottom 1.016: 36.83,120.65 RL2.5 RL2.4
N$32
  Bottom 0.406: IC5.5 45.72,85.09 45.72,93.98 40.64,97.79 40.64,104.14 45.72,107.95
  Bottom 0.813: 45.72,107.95 45.72,161.29 44.45,162.56 RL1.5
  Bottom 1.016: RL1.5 RL1.4
N$33
  Bottom 0.406: IC5.14 49.53,92.71 46.99,95.25 OUTPUT.2
N$34
  Bottom 0.406: IC5.7 50.8,85.09 50.8,93.98 49.53,95.25 OUTPUT.3
N$35
  Bottom 0.406: IC5.12 54.61,92.71 52.07,95.25 OUTPUT.4
N$36
  Bottom 0.406: IC5.9 54.61,87.63 55.88,88.9 55.88,93.98 54.61,95.25 OUTPUT.5
N$37
  Bottom 1.016: U$4.N+ 25.4,190.5 POWER.2
N$38
  Bottom 0.61: 35.56,153.67 29.21,153.67 27.94,154.94
  Bottom 1.016: U$5.OUT+ 25.4,125.73 30.48,125.73 | RL2.7 30.48,125.73 | RL1.7 29.21,167.64 27.94,166.37 27.94,154.94 | 35.56,153.67 35.56,151.13 34.29,149.86 31.75,149.86 30.48,148.59 30.48,125.73
N$39  (1 unrouted)
  Bottom 0.813: U$1.RST2 52.07,43.18 55.88,39.37 RESET.2
N$40
  Bottom 1.016: U$5.N+ 19.05,142.24 15.24,138.43 6.35,138.43 3.81,140.97 3.81,184.15 2.54,185.42 2.54,193.04 3.81,194.31 6.35,194.31 7.62,193.04 POWER1.2
RXD
  Bottom 0.406: U$1.RXD2 67.31,53.34 68.58,52.07 COM.3
SCK
  Bottom 0.813: SD.3 34.29,41.91 U$1.13
SCL
  Bottom 0.406: CLOCK.4 74.93,52.07 73.66,50.8 73.66,36.83 72.39,35.56 25.4,35.56 24.13,36.83 24.13,43.94 29.21,49.02 30.23,49.02 31.5,50.29 31.5,55.37 30.99,55.88 U$1.A5
SDA
  Bottom 0.406: CLOCK.5 76.2,49.53 74.93,48.26 74.93,35.56 73.66,34.29 15.18,34.29 14.37,35.1 14.37,40.53 26.67,52.58 26.67,58.42 U$1.A4
SS
  Bottom 0.813: SD.6 26.67,41.91 U$1.10
TEMP_SENSOR  (via drill 0.7 pad 1.42, 0.8 pad 1.42)
  Top 0.813: v29.21,66.04 v77.47,66.04 | v78.74,64.77 v78.74,46.99
  Bottom 0.813: TS1.3 80.01,8.89 78.74,10.16 78.74,17.78 80.01,19.05 | TS2.3 80.01,19.05 | 80.01,19.05 78.74,20.32 78.74,27.94 80.01,29.21 | TS3.3 80.01,29.21 | 80.01,29.21 78.74,30.48 78.74,38.1 80.01,39.37 | 80.01,39.37 TS4.3 | U$1.9 v29.21,66.04 | v77.47,66.04 v78.74,64.77 | v78.74,46.99 78.74,40.64 80.01,39.37
TXD
  Bottom 0.813: U$1.TXD2 60.96,50.8 66.04,45.72 COM.2